# EAGLE design PCB_Sch_v9 (EAGLE 9.3.0)
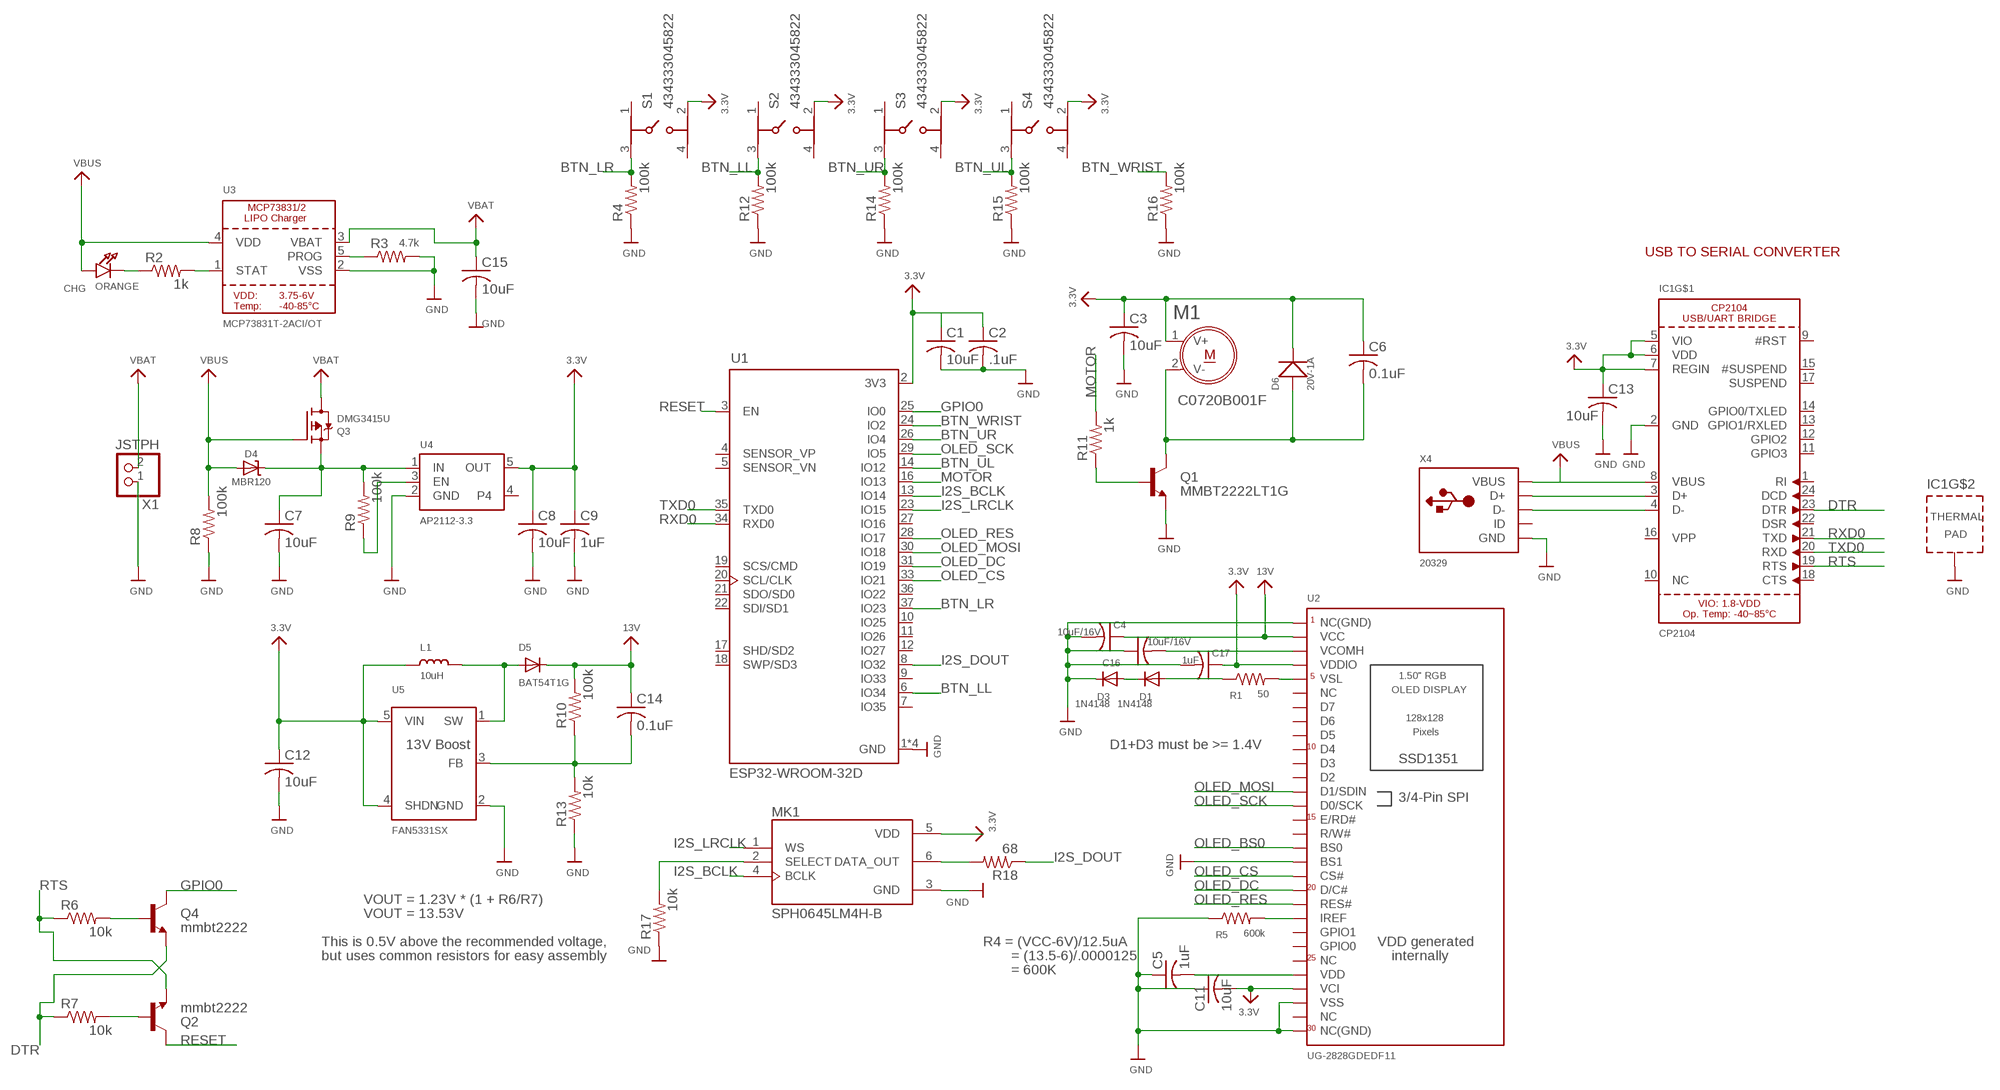
[diagram p0: schematic, sheet 1]

## Parts
C1  10uF  C-USC0603  [C0603]
C2  .1uF  C-USC0603  [C0603]
C3  10uF  C-USC0603  [C0603]
C4  10uF/16V  C-USC0603  [C0603]
C5  1uF  C-USC0603  [C0603]
C6  0.1uF  C-USC0603  [C0603]
C7  10uF  C-USC0603  [C0603]
C8  10uF  C-USC0603  [C0603]
C9  1uF  C-USC0603  [C0603]
C11  10uF  C-USC0603  [C0603]
C12  10uF  C-USC0603  [C0603]
C13  10uF  C-USC0603  [C0603]
C14  0.1uF  C-USC0603  [C0603]
C15  10uF  C-USC0603  [C0603]
C16  10uF/16V  C-USC0603  [C0603]
C17  1uF  C-USC0603  [C0603]
CHG  ORANGE  LED0805_NOOUTLINE  [CHIPLED_0805_NOOUTLINE]
D1  1N4148  DIODESOD-323  [SOD-323]
D3  1N4148  DIODESOD-323  [SOD-323]
D4  MBR120  DIODE-SCHOTTKYSOD-123  [SOD-123]
D5  BAT54T1G  DIODESOD-123  [SOD-123]
D6  20V-1A  SMD-DIODE-SCHOTTKY-20V-1A(SOD-123)  [SOD-123]
IC1  CP2104  [QFN24_4MM_SMSC]
L1  10uH  INDUCTOR  [INDUCTOR_1007]
M1  C0720B001F  [XDCR_C0720B001F]
MK1  SPH0645LM4H-B  [MIC_SPH0645LM4H-B]
Q1  MMBT2222LT1G  [SOT95P237X111-3N]
Q2  mmbt2222  TRANSISTOR_NPNSOT23-3  [SOT23-3]
Q3  DMG3415U  MOSFET-P  [SOT23-R]
Q4  mmbt2222  TRANSISTOR_NPNSOT23-3  [SOT23-3]
R1  50  R-US_R0603  [R0603]
R2  1k  R-US_R0603  [R0603]
R3  4.7k  R-US_R0603  [R0603]
R4  100k  R-US_R0603  [R0603]
R5  600k  R-US_R0603  [R0603]
R6  10k  R-US_R0603  [R0603]
R7  10k  R-US_R0603  [R0603]
R8  100k  R-US_R0603  [R0603]
R9  100k  R-US_R0603  [R0603]
R10  100k  R-US_R0603  [R0603]
R11  1k  R-US_R0603  [R0603]
R12  100k  R-US_R0603  [R0603]
R13  10k  R-US_R0603  [R0603]
R14  100k  R-US_R0603  [R0603]
R15  100k  R-US_R0603  [R0603]
R16  100k  R-US_R0603  [R0603]
R17  10k  R-US_R0603  [R0603]
R18  68  R-US_R0603  [R0603]
S1  434333045822  [434333045822]
S2  434333045822  [434333045822]
S3  434333045822  [434333045822]
S4  434333045822  [434333045822]
U1  ESP32-WROOM-32D  [MODULE_ESP32-WROOM-32D]
U2  UG-2828GDEDF11  DISP_OLED_UG-2828GDEDF11TOP  [FPC_XF2M-3015-1A]
U3  MCP73831T-2ACI/OT  MCP73831/2  [SOT23-5]
U4  AP2112-3.3  VREG_SOT23-5  [SOT23-5]
U5  FAN5331SX  FAN5331  [SOT23-5@1]
X1  JSTPH  CON_JST_PH_2PIN  [JSTPH2]
X4  20329  USB_MICRO_20329_V2  [4UCONN_20329_V2]

## Nets
3.3V: C1.1 C2.1 C3.1 C6.1 C8.1 C9.1 C11.2 C12.1 C13.1 C17.1 D6.- IC1.5(VIO) IC1.6(VDD) IC1.7(REGIN) L1.P$1 M1.1(V+) S1.2 S2.2 S3.2 S4.2 U1.2(3V3) U2.P$4(VCI) U2.P$27(VDDIO) U4.5(OUT) U5.4(SHDN) U5.5(VIN)
13V: C4.1 C14.1 D5.C R10.2 U2.P$29(VCC)
BTN_LL: R12.2 S2.3 U1.6(IO34)
BTN_LR: R4.2 S1.3 U1.37(IO23)
BTN_UL: R15.2 S4.3 U1.14(IO12)
BTN_UR: R14.2 S3.3 U1.26(IO4)
BTN_WRIST: R16.2 U1.24(IO2)
DTR: IC1.23(DTR) Q4.2(E) R7.1
GND: C1.2 C2.2 C3.2 C4.2 C5.1 C7.2 C8.2 C9.2 C11.1 C12.2 C13.2 C15.2 C16.1 C17.2 D3.C IC1.2(GND) IC1.THERM(TP) MK1.3(GND) Q1.2(E) R3.2 R4.1 R5.1 R8.1 R12.1 R13.1 R14.1 R15.1 R16.1 R17.1 U1.1(GND) U1.15(GND) U1.38(GND) U1.39(GND) U2.P$1(NC(GND)) U2.P$3(VSS) U2.P$13(BS1) U2.P$30(NC(GND)) U3.2(VSS) U4.2(GND) U5.2(GND) X1.1 X4.BASE@1(GND) X4.BASE@2(GND) X4.GND X4.SPRT@1(GND) X4.SPRT@2(GND) X4.SPRT@3(GND) X4.SPRT@4(GND)
GPIO0: Q4.3(C) U1.25(IO0)
I2S_BCLK: MK1.4(BCLK) U1.13(IO14)
I2S_DOUT: R18.1 U1.8(IO32)
I2S_LRCLK: MK1.1(WS) U1.23(IO15)
MOTOR: R11.2 U1.16(IO13)
N$1: IC1.3(D+) X4.D+
N$2: Q1.1(B) R11.1
N$3: C5.2 U2.P$5(VDD)
N$4: MK1.2(SELECT) R17.2
N$5: IC1.4(D-) X4.D-
N$6: D1.A R1.1
N$7: R1.2 U2.P$26(VSL)
N$8: Q2.1(B) R7.2
N$9: Q4.1(B) R6.2
N$10: CHG.C R2.1
N$11: D1.C D3.A
N$12: C7.1 D4.C Q3.2(S) R9.2 U4.1(IN)
N$13: D5.A L1.P$2 U5.1(SW)
N$14: R9.1 U4.3(EN)
N$15: R2.2 U3.1(STAT)
N$16: C14.2 R10.1 R13.2 U5.3(FB)
N$17: R3.1 U3.5(PROG)
N$18: C16.2 U2.P$28(VCOMH)
N$19: R5.2 U2.P$9(IREF)
N$20: C6.2 D6.+ M1.2(V-) Q1.3(C)
N$21: MK1.5(VDD) ; supply symbol labelled 3.3V
N$22: MK1.6(DATA_OUT) R18.2
OLED_BS0: U2.P$14(BS0)
OLED_CS: U1.33(IO21) U2.P$12(CS#)
OLED_DC: U1.31(IO19) U2.P$11(D/C#)
OLED_MOSI: U1.30(IO18) U2.P$18(D1/SDIN)
OLED_RES: U1.28(IO17) U2.P$10(RES#)
OLED_SCK: U1.29(IO5) U2.P$17(D0/SCK)
RESET: Q2.3(C) U1.3(EN)
RTS: IC1.19(RTS) Q2.2(E) R6.1
RXD0: IC1.21(TXD) U1.34(RXD0)
TXD0: IC1.20(RXD) U1.35(TXD0)
VBAT: C15.1 Q3.3(D) U3.3(VBAT) X1.2
VBUS: CHG.A D4.A IC1.8(VBUS) Q3.1(G) R8.2 U3.4(VDD) X4.VBUS
Unconnected: IC1.1(RI) IC1.9(#RST) IC1.10(NC) IC1.11(GPIO3) IC1.12(GPIO2) IC1.13(GPIO1/RXLED) IC1.14(GPIO0/TXLED) IC1.15(#SUSPEND) IC1.16(VPP) IC1.17(SUSPEND) IC1.18(CTS) IC1.22(DSR) IC1.24(DCD) S1.1 S1.4 S2.1 S2.4 S3.1 S3.4 S4.1 S4.4 U1.4(SENSOR_VP) U1.5(SENSOR_VN) U1.7(IO35) U1.9(IO33) U1.10(IO25) U1.11(IO26) U1.12(IO27) U1.17(SHD/SD2) U1.18(SWP/SD3) U1.19(SCS/CMD) U1.20(SCL/CLK) U1.21(SDO/SD0) U1.22(SDI/SD1) U1.27(IO16) U1.36(IO22) U2.P$2(NC) U2.P$6(NC) U2.P$7(GPIO0) U2.P$8(GPIO1) U2.P$15(R/W#) U2.P$16(E/RD#) U2.P$19(D2) U2.P$20(D3) U2.P$21(D4) U2.P$22(D5) U2.P$23(D6) U2.P$24(D7) U2.P$25(NC) U4.4 X4.ID

## Notes on the sheet
- USB TO SERIAL CONVERTER
- 13V Boost | D1+D3 must be >= 1.4V
- VOUT = 1.23V * (1 + R6/R7)
- VOUT = 13.53V
- This is 0.5V above the recommended voltage, | R4 = (VCC-6V)/12.5uA | VDD generated
- but uses common resistors for easy assembly | = (13.5-6)/.0000125 | internally
- = 600K

## Library data of the parts
C1-C9 C11-C17 = rcl:C-US: CAPACITOR, American symbol; SPICEPREFIX: C
CHG = microbuilder:LED: LED 0603 - 0603 Surface Mount Package 2mA: Green LED - Low Power (3.9mcd, 2ma, 1.7Vf) - Digikey: 475-2709-2-ND Orange LED - Low Power (9.8mcd, 2ma, 1.8Vf) - Digikey: 475-1194-2-ND Red LED - Low Power (5mcd, 2ma, 1.8Vf) - Digikey: 475-1195-2-ND Yellow LED - Low Power (7mcd, 2ma, 1.8Vf) - Digikey: 475-1196-2-ND 5mA: Blue LED - Low Power (17mcd, 5ma, 2.9Vf) - Digikey: LNJ937W8CRACT-ND 0805 - 0805 Surface Mount Package 2mA: Red LED (8.8mcd, 2mA, 1.8Vf, Clear) - Low Power [Digikey: 475-2510-1-ND] Green LED (5mcd, 2mA, 1.8Vf, Clear) - Low Power [Digikey: 475-2730-1-ND] Yellow LED (11.3mcd, 2mA, 1.8Vf, Clear) - Low Power [Digikey: 475-2555-1-ND] 20mA: Red LED (104mcd, 20mA, Diffused) - LS R976 [Digikey: 475-1278-6-ND] Red LED (12mcd, 20mA, 2.0Vf, Clear) - APT2012EC [Digikey: 754-1128-1-ND] Green LED (15mcd, 20mA, 2.2Vf, Clear) - APT2012GC [Digikey: 754-1131-1-ND] Orange LED (160mcd, 20mA, 2.1Vf, Clear) - APT2012SECK [Digikey: 754-1130-1-ND] 1206 - 1206 Surface Mount Package Green LED (26mcd, 20mA, Diffused) - LG N971 [Digikey: 475-1407-6-ND] Red LED (15mcd, 20mA, Diffused) - LH N974 [Digikey: 475-1416-6-ND] Cree - Cree High-Power Surface Mount LEDs XPEBWT-L1-0000-00D50 - White 111lm 350mA 2.9Vf 6200K 110° XTEAWT-00-0000-00000LEE3 - White 114lm 350mA 2.85Vf 5000K 115° Everlight - Everlight 45-21 Series Surface Mount LEDs 45-21/QK2C-B2832AC2CB2/2T - Warm White 2000mcd 20mA 3.25Vf 3050K 120° 45-21/LK2C-B38452C4CB2/2T - Nuetral White 2000mcd 20mA 3.25Vf 4150K 120° 45-21/LK2C-B50634C6CB2/2T - Cold White 2200mcd 20mA 3.25Vf 5650K 120° PLCC2 Reverse Mount LS T77K-J1L2-1-0-2-R18-Z - Red 11.25mcd 2mA 1.8Vf 630nm 120° LO T77K-L1M2-24-Z - Orange 19.6mcd 2mA 1.8Vf 606nm 120° LY T77K-K2M1-26-Z - Yellow 15.7mcd 2mA 1.8Vf 587nm 120°
D1 D3 D5 = microbuilder:DIODE: Diode SMA Model Volts Amps Type Vf Vr Digikey # Notes SSA34-E3 40V 3A Schottky 480mV @ 3A 200uA @ 40V SSA34-E3/61TGITR-ND CDBA120-G 20V 1A Schottky 500mV @ 1A 500uA @ 20V 641-1014-6-ND REEL MBRA210 10V 2A Schottky 350mV @ 2A 700uA @ 10V MBRA210LT3 SOD-123 Model Volts Amps Type Vf Vr Order # Notes BAT54T1G 30V 200mA Schottky 800mV @ 200mA 2uA @ 25V BAT54T1GOSTR-ND B0530W 30V 500mA Schottky 430mV @ 500mA 130uA @ 30V B0530W-FDICT-ND REEL MBR120 20V 1A Schottky 340mV @ 1A MBR120VLSFT1GOSCT-ND SOD-323 Model Volts Amps Type Vf Vr Order # Notes PMEG2005EJ 20V 500mA Schottky 355mV @ 500mA 568-4110-1-ND ZLLS410 10V 570mA Schottky 380mV @ 570mA ZLLS410CT-ND 1N4148WS 75V 150mA Silicon/Simple 1V 1N4148WSFSCT-ND REEL SOD-523 Model Volts Amps Type Vf Vr Order # Notes BAT54XV2 30V 200mA Schottky 0.8V @ 100mA BAT54XV2CT-ND TB751S 30V 30mA Schottky RB751S-40TE61CT-ND SOT23-R/W (R = Solder Paste/Reflow Ovens, W = Hand-Soldering) Model Volts Amps Type Vf Vr Order # Notes BAT54FILM 40V 300mA Schottky 497-7162-1-ND
D4 = microbuilder:DIODE-SCHOTTKY
D6 = OPL_Discrete_Semiconductor:SMD-DIODE-SCHOTTKY-20V-1A(SOD-123): 304020034; MPN: B5819W
IC1 = microbuilder:CP2104: CP2104 - USB to UART Bridge VDD Output: 3.45V
L1 = microbuilder:INDUCTOR: Inductors 0603: 10nH Ceramic Inductor - microwire antenna/RF (Digikey: 712-1434-2-ND) 0805: 560nH Ceramic Inductor - RF (Digikey: 553-1047-1-ND) 270nH Ceramic Inductor - Q = 40@250MHz, +-5%, 1 Ohm DC Resistance (Digikey: 535-10506-2-ND) 1007 (2518 Metric) SMT: 10µH 10% 250mOhm 820mA 1007 Inductor (Digikey: 587-2189-1-ND) 22µH 10% 500mOhm 580mA 1007 Inductor (Digikey: 587-2190-1-ND) 47µH 10% 950mOhm 420mA 1007 Inductor (Digikey: 587-2191-1-ND) 47µH 5% 100mOhm 1A 1008 Inductor (Digikey: 732-1816-1-ND) 5.0x5.0mm (Taiyo Yuden NR5040 Series) 6.8µH 20% 2.3A 64mOhm Inductor (Digikey: 587-2374-2-ND) 5.0x5.0mm (TDK VLC5045 Series) 4.7µH 20% 3.3A 34mOhm Inductor (Digikey: 445-6526-1-ND) 6.8µH 20% 2.7A 46mOhm Inductor (Digikey: 445-6527-1-ND) 6.0x6.0mm (TDK VLC6045 Series) 4.7µH 20% 3.8A 27mOhm Inductor (Digikey: 445-6538-2-ND) 6.8µH 20% 3A 41mOhm Inductor (Digikey: 445-6540-1-ND) 6.2µH 30% 2.2A 45mOhm Inductor (Digikey: SRR5028-6R2YCT-ND) - Not TDK VLC6045 but footprint should match 6.0x6.0mm (TDK SLF6045 Series) 6.8uH 30% 2A 33mOhm Inductor (Digikey: 445-4572-1-ND, Mouser: 810-SLF645T6R8N2R0PF) 6.0x6.0mm (Sumida CDRH5D28 Series) 6.2uH 30% 1.8A 45mOhm Inductor (Digikey: 308-1542-1-ND) Taiyo Yuden NR3015T2R2M - 2.2uH 20% 1.5A (Digikey: 587-1648-2-ND, Mouser: 963-NR3015T2R2M) - Used with TI TPS62172 CoilCraft RFID Transponder Coil - MA5532-AE (For use with AS3935 Lightning Sensor)
M1 = C0720B001F:C0720B001F: Vibration Motor Coin 3v Flex; AVAILABILITY: Unavailable; DESCRIPTION: Vibration Motor Coin 3v Flex; MF: Jinlong Machinery; MP: C0720B001F; PACKAGE: Jinlong Machinery &amp; Electronics; PRICE: None
MK1 = SPH0645LM4H-B:SPH0645LM4H-B: Mic Mems Digital I2s Omni -26db; AVAILABILITY: Unavailable; DESCRIPTION: Mic Mems Digital I2s Omni -26db; MF: Knowles; MP: SPH0645LM4H-B; PACKAGE: SIP-7 Bourns; PRICE: None
Q1 = MMBT2222LT1G:MMBT2222LT1G: Bipolar (BJT) Transistor NPN 30V 600mA 250MHz 300mW Surface Mount SOT-23-3 (TO-236)
Q2 Q4 = SparkFun:TRANSISTOR_NPN: Transistor NPN BJT configuration in SOT23 package. MMBT2222 is the common NPN we use. Double check BCE configuration again layout.
Q3 = microbuilder:MOSFET-P: P-Channel Mosfet LEGEND VDS: Voltage Drain-Source ID: Drain Current RDS(ON): Drain-Source On-State Resistance VGS(TH): Gate-Source Threshold Voltage CISS: Drain-Source Input Capacitance SOT-23 Name VDS ID RDS(ON) VGS(TH) CISS Order Number IRLML5103 30V 760mA 600 mOhm -- 75pF @ 25V Digikey: IRLML5103PBFCT-ND IRLML6401 12V 4.3A 50 mOhm 950mV @ 250µA 830pF @ 10V Digikey: IRLML6401PBFTR-ND NTR0202PL 20V 400mA 800 mOhm 2.3V @ 250uA 70pF @ 5V Digikey: NTR0202PLT1GOSTR-ND NTR4101PT1G 20V 1.8A 85 mOhm 1.2V @ 250uA 675pF @ 10V Digikey: NTR4101PT1GOSCT-ND DMP2004K 20V 600mA 900 mOhm 1V @ 250uA 175pF @ 16V Digikey: DMP2004KDICT-ND PMV65XP 20V 3.9A 76 mOhm 950mV @ 1mA 725pF @ 20V Digikey: 568-2358-2-ND TO-252 Name VDS ID RDS(ON) VGS(TH) CISS Order Number AOD417 30V 25A 34 mOhm 3V @ 250µA 920pF @ 15V Digikey: 785-1106-2-ND PowerPak Name VDS ID RDS(ON) VGS(TH) CISS Order Number AON7401 30V 12A 14 mOhm 3V @ 250µA 2600pF @ 15V Digikey: 785-1302-1-ND
R1-R18 = rcl:R-US_: RESISTOR, American symbol; SPICEPREFIX: R
S1-S4 = 434333045822:434333045822: 3.5x4.7 mm SMD J-Bend side push WS-TASU <http://katalog.we-online.de/media/images/v2/Family_WS_TUS_Normal_SMD_J-Bend_4343x30458xx_pf2.jpg> Details see: http://katalog.we-online.de/em/datasheet/4343x30458xx.pdf 2015 (C) Wurth Elektronik; AVAILABILITY: Unavailable; DESCRIPTION: Tact Switch 3.5x4.7mm Black Side push; MF: Wurth Electronics; MP: 434333045822; PACKAGE: None; PRICE: None
U1 = ESP32-WROOM-32D:ESP32-WROOM-32D: IC: SoC; GPIO, I2C, I2S, IR, SD, SDIO, SPI, UART; 2.7÷3.6VDC; 20dBm; AVAILABILITY: Unavailable; DESCRIPTION: IC: SoC; GPIO, I2C, I2S, IR, SD, SDIO, SPI, UART; 2.7÷3.6VDC; 20dBm; MF: Espressif Systems; MP: ESP32-WROOM-32D; PACKAGE: Module Espressif Systems; PRICE: None
U2 = microbuilder:DISP_OLED_UG-2828GDEDF11: 128x128 1.5" RGB OLED - UG-2828GDEDF11 30-Pin 0.5mm Pitch FPC Cable (Top+Bottom Contacts) - OMRON XF2M-3015-1A (Digikey: OR723TR-ND) This FPC connector has contacts on the top and bottom, but the appropriate pin needs to be selected depending on whether the OLED will be inserted right-side up (use the TOP pinout) or upside-down (use the BOTTOM pinout).; SPICEPREFIX: X
U3 = microbuilder:MCP73831/2: MCP73831/2 LIPO Charger VDD: 3.75 - 6V Temp -40 - 85°C Programmable Charge Rate: 15-500mA NOTE: STAT is a tri-state logic output on the MCP73831 and an open-drain output on the MCP73832. SOT23-5 with 4.2V output and tri-state logic on STAT = MCP73831T-2ACI/OT
U4 = microbuilder:VREG_SOT23-5: SOT23-5 Fixed Voltage Regulators Part Current Out V Out V In V Dropout θJA (°C/W) TJ (°C) Digikey Part No. ADP121 150mA 3.3V 3.4-5.5V 0.09V @ 150mA -- -- ADP121-AUJZ33R7CT-ND ADP121 150mA 3.0V 3.1-5.5V 0.09V @ 150mA -- -- ADP121-AUJZ30R7CT-ND ADP122 300mA 3.3V 3.4-5.5V 0.085V @ 300mA -- -- ADP122AUJZ-3.3-R7CT-ND ADP1712 300mA 3.3V 3.5-5.5V 0.17V @ 300mA -- -- ADP1712AUJZ-3.3-R7TR-ND AP7311 (Low Cost) 150mA 3.3V 3.5-6V 0.15V @ 150mA -- -- AP7311-33WG-7DICT-ND LD39015M18R 150mA 1.8V 1.9V-5.5V 0.08V @ 100mA -- -- 497-6977-1-ND LP2985A-33DBVR 150mA 3.3V 3.3-16V 0.28V @ 150mA 206 150 296-18479-1-ND MCP1824T-3302E/OT 300mA 3.3V 3.5V-6V 0.2V @ 300mA -- -- MCP1824T-3302E/OTCT-ND MIC5205-2.5YM5 TR 150mA 2.5V 2.7-16V 0.165V @ 150mA -- -- 576-1257-2-ND MIC5205-3.0YM5 TR 150mA 3.0V 3.2V-16V 0.165V @ 150mA -- -- 576-1258-2-ND MIC5205-3.3YM5 TR 150mA 3.3V 3.5V-16V 0.165V @ 150mA -- -- 576-1259-2-ND TPS780330220 150mA 3.3V+2.2V 3.6-5.5V 250mV Max -- -- 296-23332-1-ND TDA3663/N1,135 100mA 3.3V 3.5-45V 0.18V @ 50mA -- -- 568-5343-1-ND Max operating temp can be calculated using θJA, TJ (max junction temperature), and power in watts. Set the "Maximum Ambient Temperature" until it reaches TJ ("Max Junction Temperature"), which is the absolute limit for safe use of the regulator: Heat Sink Temperature Calculator <http://www.daycounter.com/Calculators/Heat-Sink-Temperature-Calculator.phtml> For example, With 12V source into a 3.3V LP2985 and a 30mA load, we are dissipating (12V-3.3V) * 0.03A = 0.261W. With a θJA of 206 °C/W, a TJ of 150°C, and 261mW we can safely use the chip without a heat sink up to 75°C (=147.1°C Junction Temperature).
U5 = microbuilder:FAN5331: FAN5331 - LED/OLED 20V Boost Converter Digikey: FAN5331SXCT-ND
X1 = microbuilder:CON_JST_PH_2PIN: JST 2-Pin Right-Angle Connector PH-Series - 4UConnector: 17311 SH-Series - 4UConnector: 07278
X4 = microbuilder:USB: USB Connectors USBMINIB - Surface Mount Female Mini-B USB Connector 4UConnector: 06564

## Board
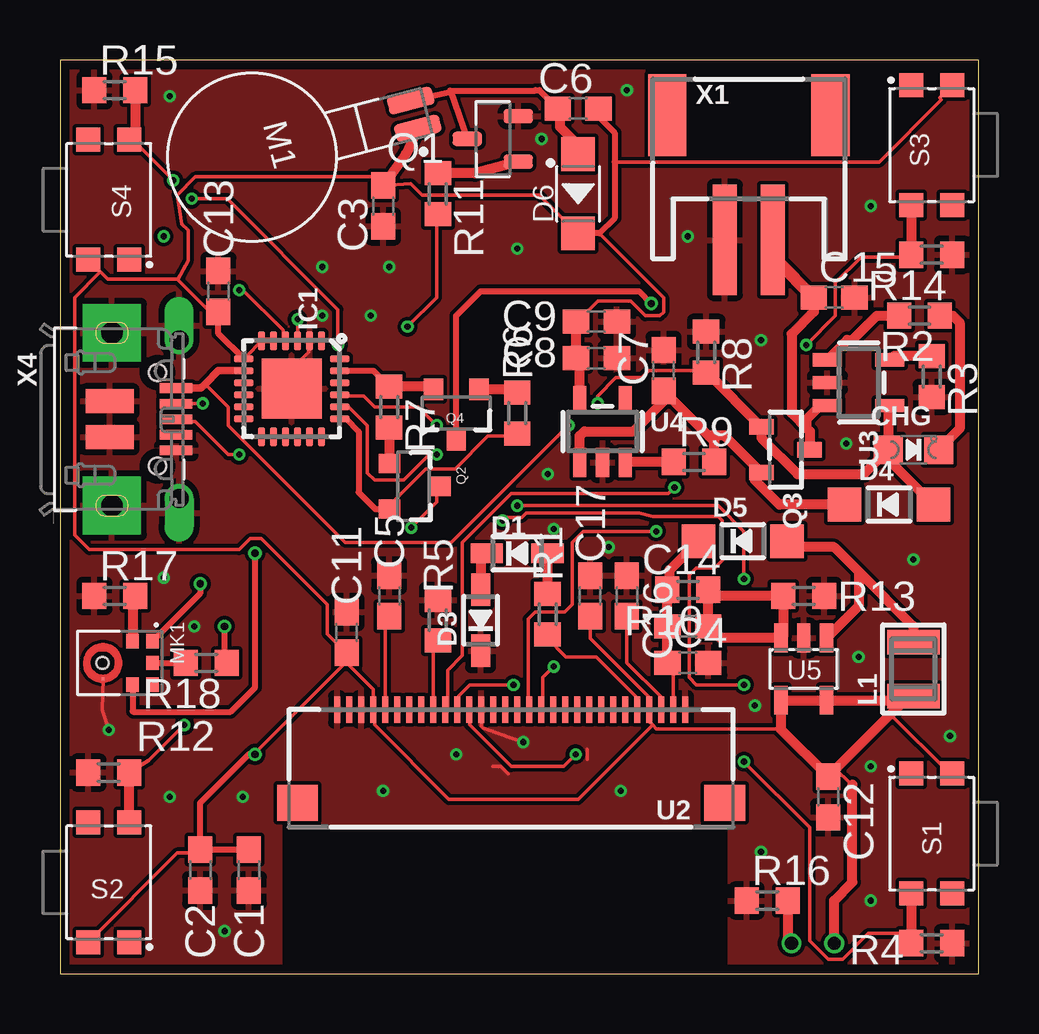
[diagram p1: board, top side]
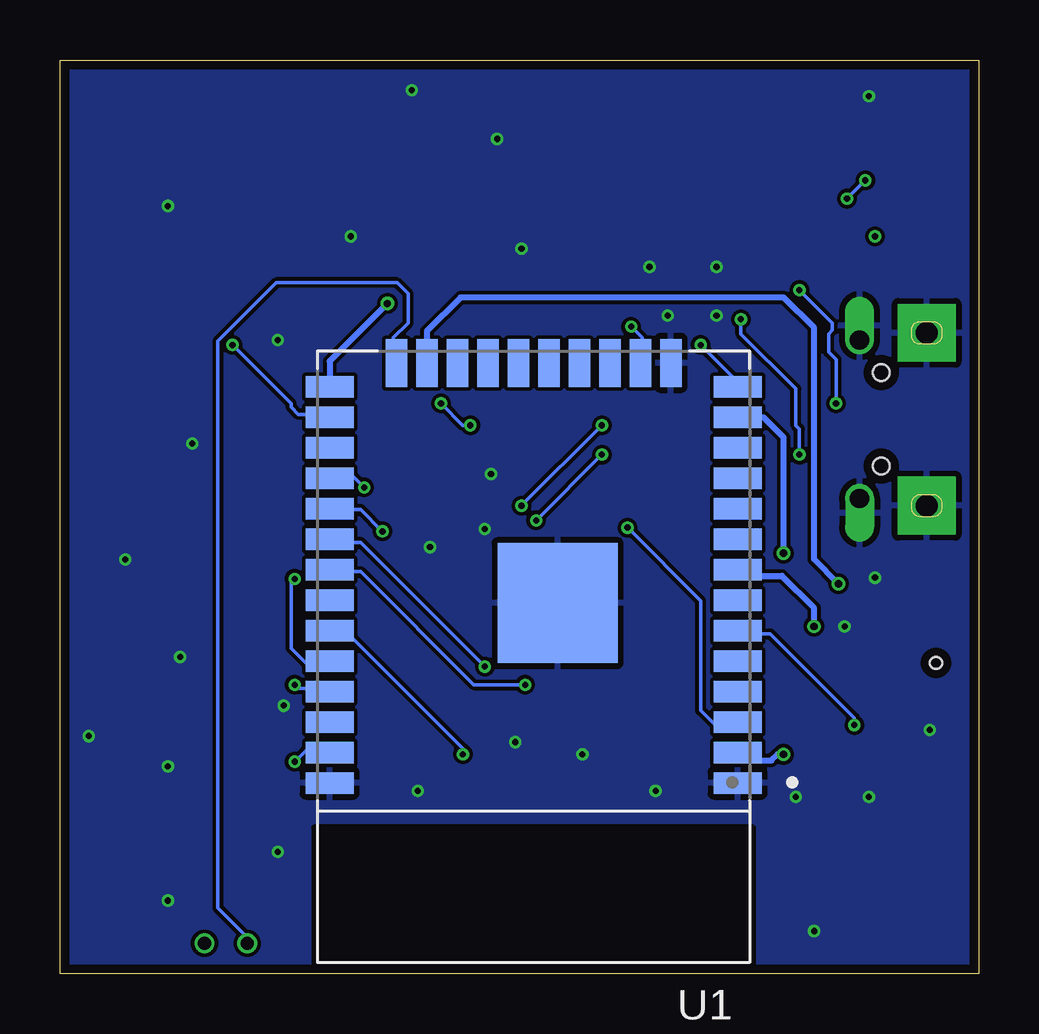
[diagram p2: board, bottom side, seen from below]

Size 38.28 x 38.09 mm. Coordinates in mm from the lower left corner, seen from the top.
Outline: 0,0 38.28,0 38.28,38.09 0,38.09 0,0
Copper layers (1*16): Top 0.035559375mm / dielectric 1.6mm / Bottom 0.035559375mm
Design rules "oshpark-2layer": minimum track width 6mil, minimum drill 10mil, track to track 6mil, track to pad 6mil, pad to pad 6mil, via to via 6mil, smd to smd 6mil, copper to edge 15mil, drill to drill 6mil, minimum pad ring 5mil, minimum via ring 5mil, stop-mask expansion 2.5mil, vias tented up to drill 0mil, thermal gap 10mil

### Footprints (pad centres in the part's own frame; a part is rotated, then mirrored left to right if it is on the bottom)
C0603 = smd 1.1 x 1: 1 -0.85,0; 2 0.85,0
CHIPLED_0805_NOOUTLINE = smd 1.2 x 1.2: A 0,-1.05; C 0,1.05
SOD-323 = smd 1.35 x 0.8: A 1.27,0; C -1.27,0
SOD-123 = smd 1.4 x 1.4: A 1.85,0; C -1.85,0
SOD-123' = smd 1.397 x 1.397: + -1.651,0; - 1.651,0
QFN24_4MM_SMSC = smd 0.8 x 0.28: 1 -2,1.25; 2 -2,0.75; 3 -2,0.25; 4 -2,-0.25; 5 -2,-0.75; 6 -2,-1.25; 13 2,-1.25; 14 2,-0.75; 15 2,-0.25; 16 2,0.25; 17 2,0.75; 18 2,1.25 | smd 0.28 x 0.8: 7 -1.25,-2; 8 -0.75,-2; 9 -0.25,-2; 10 0.25,-2; 11 0.75,-2; 12 1.25,-2; 19 1.25,2; 20 0.75,2; 21 0.25,2; 22 -0.25,2; 23 -0.75,2; 24 -1.25,2 | smd 2.5 x 2.5: THERM 0,0
INDUCTOR_1007 = smd 1.016 x 2.2: P$1 -1.127,0; P$2 1.127,0
XDCR_C0720B001F = smd 0.76 x 1.94: 1 -0.6,-5.02; 2 0.6,-5.02
MIC_SPH0645LM4H-B = smd 0.6 x 0.522: 1 -0.9,2.074; 2 -0.9,1.252; 4 0.9,1.252; 5 0.9,2.074; 6 0,2.074 | smd 0.1 x 0.1: 3 0.65,0.02 | hole 0.5: 0,0
SOT95P237X111-3N = smd 1.23 x 0.6: 1 -1.06,0.95; 2 -1.06,-0.95; 3 1.06,0
SOT23-3 = smd 0.8 x 0.9: 1 -0.95,-1; 2 0.95,-1; 3 0,1.1
SOT23-R = smd 0.635 x 1.016: 1 -0.95,-1; 2 0.95,-1; 3 0,1
R0603 = smd 1 x 1.1: 1 -0.85,0; 2 0.85,0
434333045822 = smd 1 x 1: 1 2.5,0.85; 2 2.5,-0.85; 3 -2.5,0.85; 4 -2.5,-0.85
MODULE_ESP32-WROOM-32D = smd 2 x 0.9: 1 -8.5,5.26; 2 -8.5,3.99; 3 -8.5,2.72; 4 -8.5,1.45; 5 -8.5,0.18; 6 -8.5,-1.09; 7 -8.5,-2.36; 8 -8.5,-3.63; 9 -8.5,-4.9; 10 -8.5,-6.17; 11 -8.5,-7.44; 12 -8.5,-8.71; 13 -8.5,-9.98; 14 -8.5,-11.25; 25 8.5,-11.25; 26 8.5,-9.98; 27 8.5,-8.71; 28 8.5,-7.44; 29 8.5,-6.17; 30 8.5,-4.9; 31 8.5,-3.63; 32 8.5,-2.36; 33 8.5,-1.09; 34 8.5,0.18; 35 8.5,1.45; 36 8.5,2.72; 37 8.5,3.99; 38 8.5,5.26 | smd 0.9 x 2: 15 -5.715,-12.25; 16 -4.445,-12.25; 17 -3.175,-12.25; 18 -1.905,-12.25; 19 -0.635,-12.25; 20 0.635,-12.25; 21 1.905,-12.25; 22 3.175,-12.25; 23 4.445,-12.25; 24 5.715,-12.25 | smd 5 x 5: 39 -1,-2.24
FPC_XF2M-3015-1A = smd 0.25 x 1.1: P$1 7.25,-2.63; P$2 6.75,-2.63; P$3 6.25,-2.63; P$4 5.75,-2.63; P$5 5.25,-2.63; P$6 4.75,-2.63; P$7 4.25,-2.63; P$8 3.75,-2.63; P$9 3.25,-2.63; P$10 2.75,-2.63; P$11 2.25,-2.63; P$12 1.75,-2.63; P$13 1.25,-2.63; P$14 0.75,-2.63; P$15 0.25,-2.63; P$16 -0.25,-2.63; P$17 -0.75,-2.63; P$18 -1.25,-2.63; P$19 -1.75,-2.63; P$20 -2.25,-2.63; P$21 -2.75,-2.63; P$22 -3.25,-2.63; P$23 -3.75,-2.63; P$24 -4.25,-2.63; P$25 -4.75,-2.63; P$26 -5.25,-2.63; P$27 -5.75,-2.63; P$28 -6.25,-2.63; P$29 -6.75,-2.63; P$30 -7.25,-2.63 | smd 1.7 x 1.5: SUPPORT1 8.9,1.27; SUPPORT2 -8.9,1.27
SOT23-5 = smd 0.55 x 1.2: 1 -0.95,-1.3; 2 0,-1.3; 3 0.95,-1.3; 4 0.95,1.3; 5 -0.95,1.3
SOT23-5@1 = smd 0.55 x 1.2: 1 -0.95,-1.3; 2 0,-1.3; 3 0.95,-1.3; 4 0.95,1.3; 5 -0.95,1.3
JSTPH2 = smd 1 x 4.6: 1 -1,-3.7; 2 1,-3.7 | smd 1.6 x 3.4: NC1 -3.4,1.5; NC2 3.4,1.5
4UCONN_20329_V2 = smd 1 x 2: BASE@1 -0.75,-2; BASE@2 0.75,-2 | smd 0.4 x 1.35: D+ 0,0.775; D- -0.65,0.775; GND 1.3,0.775; ID 0.65,0.775; VBUS -1.3,0.775 | drill 0.8 pad 1.143 offset: SPRT@1 -3.3,0.9; SPRT@2 3.3,0.9 | drill 0.9 pad 2.413 square: SPRT@3 -3.6,-1.9; SPRT@4 3.6,-1.9 | hole 0.7: -1.95,0; 1.95,0

### Placement (x,y rotation side)
C1  7.87,4.32 270 top
C2  5.84,4.32 270 top
C3  13.46,32 270 top
C4  26.16,12.95 0 top
C5  13.72,15.75 270 top
C6  21.59,36.07 180 top
C7  25.15,25.15 90 top
C8  22.35,25.65 0 top
C9  22.35,27.18 0 top
C11  11.94,14.22 270 top
C12  32,7.37 270 top
C13  6.6,28.45 90 top
C14  26.16,14.48 0 top
C15  32.26,28.19 0 top
C16  23.62,15.75 270 top
C17  22.1,15.75 90 top
CHG  35.56,21.84 270 top
D1  19.05,17.53 0 top
D3  17.53,14.73 90 top
D4  34.54,19.56 0 top
D5  28.45,18.03 0 top
D6  20V-1A  [SOD-123']  21.59,32.51 270 top
IC1  9.65,24.38 270 top
L1  35.56,12.7 90 top
M1  9.91,34.54 104.7 top
MK1  1.78,12.95 270 top
Q1  18.03,34.8 180 top
Q2  14.73,20.32 270 top
Q3  30.23,21.84 270 top
Q4  16.51,23.37 180 top
R1  20.32,14.99 270 top
R2  35.81,27.43 180 top
R3  36.32,24.89 270 top
R4  36.32,1.27 180 top
R5  15.75,14.73 270 top
R6  19.05,23.37 90 top
R7  13.72,23.62 270 top
R8  26.92,25.91 270 top
R9  26.42,21.34 0 top
R10  26.16,16 180 top
R11  15.75,32.51 270 top
R12  2.03,8.38 0 top
R13  30.99,15.75 180 top
R14  36.32,29.97 180 top
R15  2.29,36.83 0 top
R16  29.46,3.05 0 top
R17  2.29,15.75 0 top
R18  6.1,12.95 180 top
S1  36.32,5.84 90 top
S2  2.03,3.81 270 top
S3  36.32,34.54 90 top
S4  2.03,32.26 270 top
U1  18.54,13.21 180 bottom
U2  18.8,8.38 180 top
U3  33.27,24.64 270 top
U4  22.61,22.61 0 top
U5  30.99,12.7 180 top
X1  28.7,34.29 0 top
X4  4.06,23.11 270 top

### Tracks (layer width: path | path; a pad name or v marks a point on that pad's centre or on a via)
3.3V  (via drill 0.3, 0.55)
  Top 0.152: C11.2 11.94,12.95 13.05,11.85 U2.P$4 13.11,10.97 13.11,10.36 16.2,7.26 21.59,7.26 24.69,10.36 | C17.1 22.1,13.97 24.55,11.52 U2.P$27 24.54,10.97 24.54,10.52 24.69,10.36 | IC1.6 8.38,26.36 7.77,25.76 IC1.7 | 4.9,28.93 4.88,28.96 1.98,28.96 1.68,29.26 | 4.9,28.93 6.1,27.74 6.55,27.74 C13.1 | 1.68,29.26 1.22,29.72 S4.2 1.68,29.26 | 23.11,33.83 34.14,33.83 36.73,36.42 36.65,36.52 S3.2 | 22.48,30.86 25.15,28.19 25.15,27.58 24.99,27.43 24.38,27.43 23.77,28.04 22.4,28.04 21.64,27.28 C9.1 | D6.- 21.49,30.94 19.96,32.46 15.09,32.46 14.62,32.93 C3.1 13.19,33.22 5.64,33.22 4.88,32.46 5.08,31.24 5.33,30.99 5.33,29.72 4.9,28.93 | 34.6,10.81 37.03,8.38 S1.2 | U5.5 32,11.43 32,11.4 | 33.02,7.87 32.92,7.92 32.31,8.53 C12.1 | 24.69,10.36 24.84,10.21 29.87,10.21 30.04,10.18 | C2.1 5.84,5.03 4.88,5.03 S2.2 | 8.08,9.14 11.89,12.95 C11.2 | 1.68,29.26 0.61,28.19 0.61,18.29 1.22,17.68 7.47,17.68 7.92,18.14 8.38,18.14 11.12,15.39 11.12,14.17 11.89,13.41 C11.2
  Top 0.254: v8.13,9.14 8.08,9.14 7.87,9.14 5.84,7.11 C2.1 C1.1 | IC1.7 6.6,26.68 C13.1 | IC1.5 IC1.6 | C6.1 22.44,35.73 23.11,35.05 23.11,33.83 23.11,31.5 22.48,30.86 D6.-
  Top 0.406: 35.19,11.4 32,11.4 U5.5 U5.4 30.04,10.18 C12.1 34.6,10.81 35.19,11.4 | L1.P$1 35.39,11.4 35.19,11.4 | M1.1 14.42,34.19 C3.1 | U4.5 21.66,25.5 C8.1 C9.1 | v32.26,1.27 32.26,3.05 33.02,3.81 33.02,7.87
  Bottom 0.152: 9.91,8.89 9.91,9.14 U1.2
  Bottom 0.254: 9.91,8.89 8.64,8.89 8.38,9.14 v8.13,9.14
13V
  Top 0.152: U2.P$29 25.55,12.72 C4.1
  Top 0.406: C4.1 C14.1 R10.2 25.4,16.09 25.4,16.84 D5.C
BTN_LL  (via drill 0.25)
  Top 0.152: v5.18,10.36 3.7,8.88 R12.2
  Top 0.406: S2.3 R12.2
  Bottom 0.152: v5.18,10.36 5.18,10.67 8.69,14.17 9.91,14.17 U1.6
BTN_LR  (via drill 0.25)
  Top 0.152: v28.5,8.84 31.24,6.1 31.24,1.37 32,0.61 32.61,0.61 33.68,1.68 35.01,1.68 R4.2
  Top 0.406: S1.3 R4.2
  Bottom 0.152: v28.5,8.84 28.04,9.3 27.13,9.3 U1.37
BTN_UL  (via drill 0.25)
  Top 0.152: v4.72,33.07 3.05,34.75 S4.3 | v5.49,32.31 6.96,32.31 11.58,27.69 v11.58,26.21
  Top 0.406: R15.2 3.14,35.01 S4.3
  Bottom 0.152: v5.49,32.31 v4.72,33.07 | v11.58,26.21 9.91,24.54 U1.14
BTN_UR  (via drill 0.25)
  Top 0.152: v31.09,26.21 32.31,27.43 32.31,28.8 33.38,29.87 35.36,29.87 R14.2
  Top 0.406: S3.3 R14.2
  Bottom 0.152: v31.09,26.21 28.65,23.77 28.65,23.62 28.35,23.32 27.13,23.32 U1.26
BTN_WRIST  (via drill 0.55)
  Top 0.406: R16.2 30.31,1.44 v30.48,1.27
  Bottom 0.152: v30.48,1.27 30.48,1.52 31.7,2.74 31.7,26.36 29.26,28.8 24.23,28.8 23.77,28.35 23.77,27.13 24.38,26.52 24.38,25.6 U1.24
CUT
  cutout Top: 9.4,6.1 27.69,6.1 27.69,0.25 9.4,0.25
  cutout Bottom: 9.4,6.1 27.69,6.1 27.69,0.25 9.4,0.25
DTR
  Top 0.254: IC1.23 13.05,25.13 R7.1
  Top 0.406: Q4.2 15.46,24.47 R7.1
GND  (via drill 0.25)
  Top 0.152: IC1.THERM 9.75,24.38 9.75,25.3 10.36,25.91 10.36,26.36 IC1.2 | 21.97,9.34 21.97,8.94 | 18.67,8.33 18.36,8.64 18.03,8.64 | U2.P$13 17.55,10.32 17.61,10.25 v19.3,9.65 | MK1.3 1.76,10.99 v2.03,10.16
  other vias: 28.96,11.18 33.27,13.21 37.08,9.91 35.56,17.27 23.37,7.62 29.21,5.08 13.46,7.62 33.78,3.05 33.78,8.64 6.86,1.78 7.62,7.37 4.57,7.37 4.57,36.58 10.92,29.46 13.72,29.46 20.07,34.8 19.05,30.23 26.16,30.73 23.62,36.83 33.78,32 29.21,26.42 10.92,27.43 12.95,27.43 4.32,16.51 5.59,14.48 32.77,22.1 22.86,17.78 20.32,20.83 16.51,9.14 20.57,18.54
  pour Top: 0,38.1 0,0 38.35,0 38.35,38.1
  pour Bottom: 0,38.1 0,0 38.35,0 38.35,38.1
GND1  (via drill 0.25)
  other vias: 4.32,30.73
GPIO0  (via drill 0.3)
  Top 0.254: Q4.3 16.51,27.43 17.53,28.45 24.13,28.45 v24.64,27.94
  Bottom 0.254: v24.64,27.94 27.04,25.54 U1.25
I2S_BCLK  (via drill 0.3)
  Top 0.254: MK1.4 3.03,10.94 3.05,10.92 7.11,10.92 8.13,11.94 v8.13,17.53
  Bottom 0.254: v8.13,17.53 8.13,22.35 8.96,23.19 U1.13
I2S_DOUT  (via drill 0.3)
  Top 0.254: R18.1 6.86,13.04 v6.86,14.48
  Bottom 0.254: v6.86,14.48 6.86,15.24 8.2,16.58 9.79,16.58 U1.8
I2S_LRCLK  (via drill 0.3)
  Top 0.254: v5.84,16.26 5.84,15.84 MK1.1
  Bottom 0.254: v5.84,16.26 6.86,17.27 6.86,26.92 8.13,28.19 21.59,28.19 22.99,26.8 U1.23
MOTOR  (via drill 0.25)
  Top 0.152: v14.48,26.98 15.7,28.19 15.7,31.55 R11.2
  Bottom 0.152: v14.48,26.98 14.02,26.52 14.02,25.6 U1.16
N$1  (via drill 0.25)
  Top 0.152: v9.91,27.28 9.91,26.52 IC1.3 | v7.47,21.64 7.01,21.64 5.64,23.01 4.88,23.01 X4.D+
  Bottom 0.152: v9.91,27.28 9.91,26.67 7.62,24.38 7.62,22.86 7.47,22.71 v7.47,21.64
N$2
  Top 0.406: Q1.1 17.29,33.36 R11.1
N$3
  Top 0.152: C5.2 13.55,14.73 U2.P$5
N$4
  Top 0.406: R17.2 3.03,15.64 MK1.2
N$5  (via drill 0.25)
  Top 0.152: v7.47,28.5 7.62,28.5 9.3,26.82 9.3,26.52 IC1.4 | v5.94,23.77 4.88,23.77 X4.D-
  Bottom 0.152: v7.47,28.5 6.1,27.13 6.1,26.82 6.25,26.67 6.25,25.91 5.94,25.6 v5.94,23.77
N$6
  Top 0.406: R1.1 D1.A
N$7
  Top 0.152: R1.2 20.32,13.97 21.08,13.21 22.35,13.21 24.1,11.45 24.08,11.43 24.08,11.12 U2.P$26
N$8
  Top 0.406: Q2.1 13.73,22.76 R7.2
N$9
  Top 0.406: Q4.1 18.9,24.37 R6.2
N$10
  Top 0.406: R2.1 37.2,27.43 37.48,27.15 37.48,22.72 CHG.C
N$11
  Top 0.406: D1.C 17.53,17.27 D3.A
N$12
  Top 0.406: R9.2 27.27,22.18 27.01,22.43 | 27.01,22.43 C7.1 25.15,23.88 23.88,22.61 21.84,22.61 21.66,22.42 U4.1 | D4.C 29.97,19.56 28.96,20.57 28.96,20.62 Q3.2 27.68,22.43 27.01,22.43
N$13
  Top 0.406: D5.A 30.55,17.78 32.26,17.78 33.27,16.76 | U5.1 33.27,15.34 33.27,16.76 | 33.27,16.76 35.56,14.48 L1.P$2
N$14
  Top 0.406: R9.1 23.59,21.34 U4.3
N$15
  Top 0.406: U3.1 32.8,26.42 33.02,26.42 34.04,27.43 R2.2
N$16
  Top 0.406: C14.2 R10.1 27.27,15.75 R13.2 30.14,14.1 U5.3 27.49,14 C14.2
N$17
  Top 0.406: R3.1 34.73,25.74 U3.5
N$18
  Top 0.152: U2.P$28 25.05,11.53 23.62,12.95 C16.2
N$19
  Top 0.152: R5.2 15.55,13.68 U2.P$9
N$20
  Top 0.254: M1.2 16.27,36.77 | 16.27,36.77 16.26,36.82 19.8,36.82 19.81,36.83 19.98,36.83 C6.2 | 16.27,36.77 Q1.3
  Top 0.406: C6.2 20.83,35.98 20.83,35.31 21.59,34.54 D6.+
N$22
  Top 0.254: MK1.6 R18.2
OLED_CS  (via drill 0.25)
  Top 0.152: v21.49,9.14 20.98,8.64 18.8,8.64 17.07,10.36 17.07,10.97 U2.P$12
  Bottom 0.152: v21.49,9.14 21.49,9.4 26.26,14.17 26.98,14.17 U1.33
OLED_DC  (via drill 0.25)
  Top 0.152: v18.9,12.04 17.07,12.04 16.61,11.58 16.61,11.12 U2.P$11
  Bottom 0.152: v18.9,12.04 21.03,12.04 25.76,16.76 26.98,16.76 U1.31
OLED_MOSI  (via drill 0.25)
  Top 0.152: v20.57,12.8 20.12,12.34 20.12,11.12 U2.P$18
  Bottom 0.152: v20.57,12.8 25.76,17.98 26.98,17.98 U1.30
OLED_RES  (via drill 0.25)
  Top 0.152: U2.P$10 16.15,11.12 16.15,12.65 16.76,13.26 16.76,17.98 18.8,20.02 25.35,20.02 v25.6,20.27
  Bottom 0.152: v25.6,20.27 26.06,20.73 26.98,20.73 U1.28
OLED_SCK  (via drill 0.25)
  Top 0.152: v24.84,18.44 21.79,18.44 21.34,17.98 21.34,15.39 21.03,15.09 19.81,15.09 19.51,14.78 19.51,11.12 U2.P$17
  Bottom 0.152: v24.84,18.44 25.76,19.36 26.98,19.36 U1.29
RESET  (via drill 0.25)
  Top 0.152: v14.63,18.59 15.7,19.66 15.7,20.27 Q2.3
  Bottom 0.152: v14.63,18.59 11.58,15.54 11.58,10.97 10.97,10.36 10.06,10.36 U1.3
RTS
  Top 0.152: R6.1 19.05,22.4 17.83,22.4 16.46,21.03 15.24,21.03 13.72,19.51 Q2.2
  Top 0.254: IC1.19 11.92,23.13 12.45,22.61 12.45,20.07 13.14,19.37 Q2.2
RXD0  (via drill 0.25)
  Top 0.152: v15.7,22.86 14.94,23.62 13.11,23.62 12.65,24.08 11.73,24.08 IC1.21 | v19.05,19.51 27.43,19.51 28.5,18.44 v28.5,16.46
  Bottom 0.152: v19.05,19.51 v15.7,22.86 | v28.5,16.46 28.65,16.31 28.65,13.56 28.04,12.95 27.13,12.95 U1.34
TXD0  (via drill 0.25)
  Top 0.152: v15.7,21.64 15.39,21.64 14.33,20.57 13.11,20.57 12.8,20.88 12.8,22.86 12.04,23.62 11.73,23.62 IC1.20 | v28.5,12.04 26.52,12.04 26.21,12.34 26.21,16.61 26.52,16.92 27.28,16.92 27.58,17.22 27.58,18.9 27.43,19.05 24.69,19.05 24.13,19.2 19.43,19.2 19.25,19.02 18.57,19.02 v18.44,18.9
  Bottom 0.152: v18.44,18.9 v15.7,21.64 | v28.5,12.04 28.35,11.89 27.13,11.89 U1.35
VBAT
  Top 0.152: 29.88,29.72 29.72,29.87 29.72,30.48 X1.2
  Top 0.406: C15.1 31.41,27.6 30.48,26.67 30.48,23.37 31.11,22.73 | U3.3 31.68,23.69 31.11,23.12 31.11,22.73 | 31.11,22.73 31.24,22.61 31.24,21.86 Q3.3
  Top 0.508: C15.1 29.88,29.72
VBUS  (via drill 0.25)
  Top 0.152: 6.04,24.59 7.01,23.62 7.01,22.86 11.89,17.98 16.31,17.98 v21.18,22.86 | v22.4,23.77 22.4,24.08 23.16,24.84 24.23,24.84 24.54,25.15 26.82,25.15 R8.2
  Top 0.305: X4.VBUS 5.87,24.41 6.04,24.59 6.6,25.15 7.64,25.15 IC1.8
  Top 0.406: U3.4 34.51,23.62 CHG.A | CHG.A 34.51,21.44 D4.A | R8.2 26.96,25.06 Q3.1 29.23,22.34 30.73,20.83 33.49,20.83 CHG.A
  Bottom 0.152: v21.18,22.86 21.49,22.86 v22.4,23.77